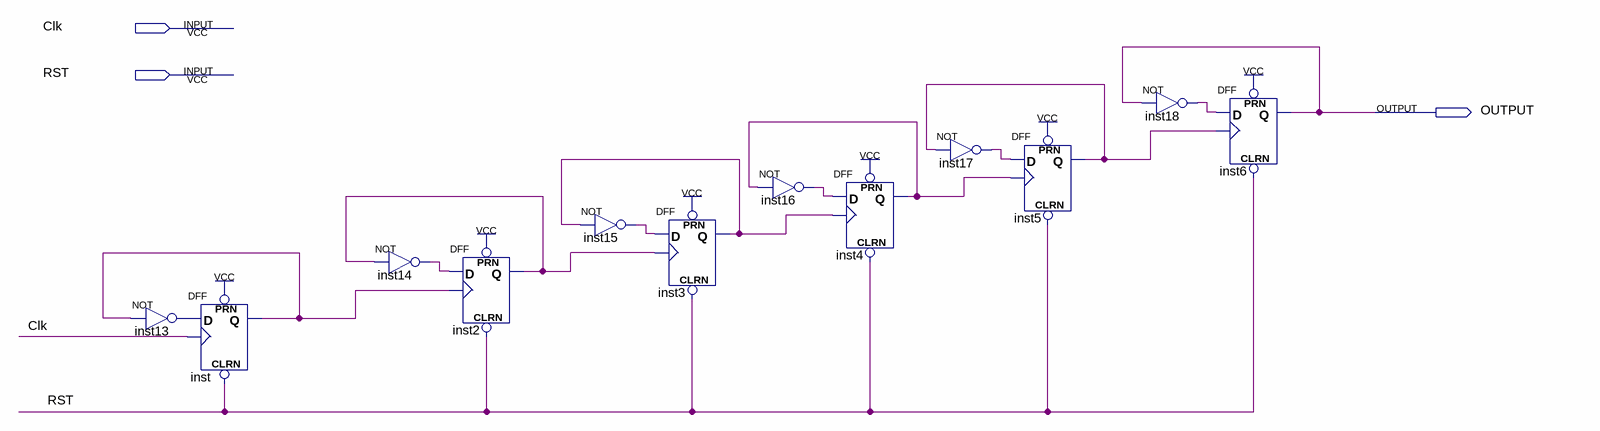
[diagram p0: schematic sheet]
// Quartus schematic div6.bdf as structural Verilog: 12 symbols, 3 pins
module div6 (
  input  Clk,
  input  RST,
  output OUTPUT
);

  wire inst2_q, inst3_q, inst4_q, inst5_q, inst13_out, inst14_out, inst15_out, inst16_out, inst17_out,
       inst18_out, inst_q;

  DFF inst (.CLRN(RST), .CLK(Clk), .D(inst13_out), .PRN(1'b1), .Q(inst_q));
  not inst13 (inst13_out, inst_q);
  not inst14 (inst14_out, inst2_q);
  DFF inst2 (.CLRN(RST), .CLK(inst_q), .D(inst14_out), .PRN(1'b1), .Q(inst2_q));
  not inst15 (inst15_out, inst3_q);
  DFF inst3 (.CLRN(RST), .CLK(inst2_q), .D(inst15_out), .PRN(1'b1), .Q(inst3_q));
  not inst16 (inst16_out, inst4_q);
  DFF inst4 (.CLRN(RST), .CLK(inst3_q), .D(inst16_out), .PRN(1'b1), .Q(inst4_q));
  not inst17 (inst17_out, inst5_q);
  DFF inst5 (.CLRN(RST), .CLK(inst4_q), .D(inst17_out), .PRN(1'b1), .Q(inst5_q));
  not inst18 (inst18_out, OUTPUT);
  DFF inst6 (.CLRN(RST), .CLK(inst5_q), .D(inst18_out), .PRN(1'b1), .Q(OUTPUT));
endmodule
